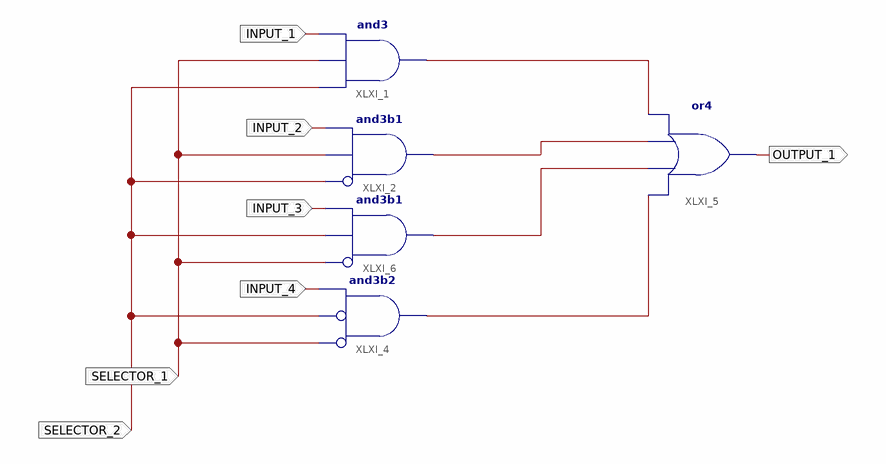
[diagram p0: schematic sheet 1]
// Xilinx ISE schematic MUX_4Channel_Schematic.sch (artix7) as structural Verilog: 5 symbols, 7 ports
module MUX_4Channel_Schematic (
  input  INPUT_1,
  input  INPUT_2,
  input  INPUT_3,
  input  INPUT_4,
  input  SELECTOR_1,
  input  SELECTOR_2,
  output OUTPUT_1
);

  wire XLXN_1, XLXN_2, XLXN_3, XLXN_4;

  and XLXI_1 (XLXN_1, SELECTOR_2, SELECTOR_1, INPUT_1);
  and XLXI_2 (XLXN_2, ~SELECTOR_2, SELECTOR_1, INPUT_2);  // and3b1
  and XLXI_4 (XLXN_4, ~SELECTOR_1, ~SELECTOR_2, INPUT_4);  // and3b2
  or XLXI_5 (OUTPUT_1, XLXN_4, XLXN_3, XLXN_2, XLXN_1);
  and XLXI_6 (XLXN_3, ~SELECTOR_1, SELECTOR_2, INPUT_3);  // and3b1
endmodule
